# Altium schematic sheet Sheet1.SchDoc
size A4; SheetNumber: 1; SheetTotal: 1
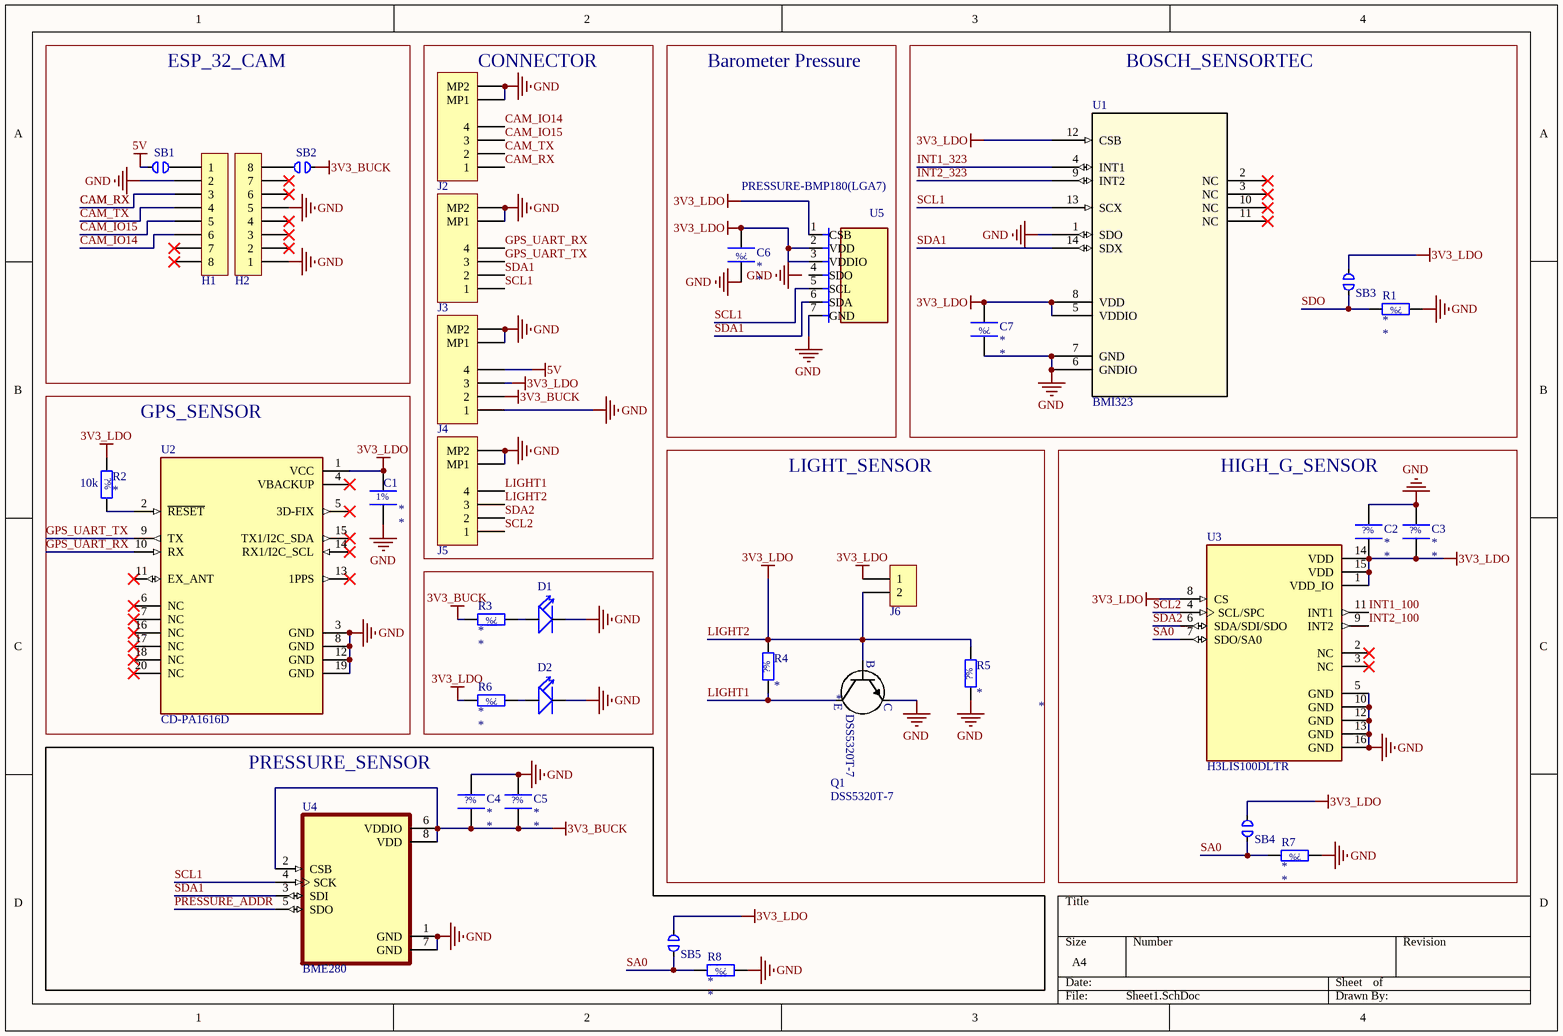
[diagram p0: Sheet1.SchDoc]

## Parts
C1  *  [CAPACITOR_0805_2012M-70N]
C2  *  [CAPACITOR_0805_2012M-70N]
C3  *  [CAPACITOR_0805_2012M-70N]
C4  *  [CAPACITOR_0805_2012M-70N]
C5  *  [CAPACITOR_0805_2012M-70N]
C6  *  [CAPACITOR_0805_2012M-70N]
C7  *  [CAPACITOR_0805_2012M-70N]
D1  LED-SMD-RED-DIFFUSED(0603)  [LED-0603]  (value not drawn)
D2  LED-SMD-RED-DIFFUSED(0603)  [LED-0603]  (value not drawn)
H1  HDR,2.54mm,1x8  [HEADER_2.54MM_1x8PIN]  (value not drawn)  (no BOM)
H2  HDR,2.54mm,1x8  [HEADER_2.54MM_1x8PIN]  (value not drawn)  (no BOM)
J2  0533980471  [MOLEX_0533980471]  (value not drawn)
J3  0533980471  [MOLEX_0533980471]  (value not drawn)
J4  0533980471  [MOLEX_0533980471]  (value not drawn)
J5  0533980471  [MOLEX_0533980471]  (value not drawn)
J6  0530470210  [MOLEX_0530470210]  (value not drawn)
Q1  DSS5320T-7  [SOT23-3N-1.15mm]
R1  *  [RESISTOR_0805_2012M-50N]
R2  R1: 10k  [RESISTOR_0805_2012M-50N]  (hidden comment: 5=Value)
R3  *  [RESISTOR_0805_2012M-50N]
R4  *  [RESISTOR_0805_2012M-50N]
R5  *  [RESISTOR_0805_2012M-50N]
R6  *  [RESISTOR_0805_2012M-50N]
R7  *  [RESISTOR_0805_2012M-50N]
R8  *  [RESISTOR_0805_2012M-50N]
SB1  Solder Jumper Normally Open  [Solder bridge Chevron 0603 Open]  (value not drawn)  (no BOM)
SB2  Solder Jumper Normally Open  [Solder bridge Chevron 0603 Open]  (value not drawn)  (no BOM)
SB3  Solder Jumper Normally Open  [Solder bridge Chevron 0603 Open]  (value not drawn)  (no BOM)
SB4  Solder Jumper Normally Open  [Solder bridge Chevron 0603 Open]  (value not drawn)  (no BOM)
SB5  Solder Jumper Normally Open  [Solder bridge Chevron 0603 Open]  (value not drawn)  (no BOM)
U1  BMI323  [BMI323_BOS]
U2  CD-PA1616D  [XCVR_CD-PA1616D]
U3  H3LIS100DLTR  [PQFN50P300X300X100-16N]
U4  BME280  [PSON65P250X250X100-8N]
U5  PRESSURE-BMP180(LGA7)  [LGA7-1.5-3.8X3.6MM]

## Blocks framed on the sheet
ESP_32_CAM: H1 H2 SB1 SB2
CONNECTOR: J2-J5
Barometer Pressure: C6 U5
BOSCH_SENSORTEC: C7 R1 SB3 U1
GPS_SENSOR: C1 R2 U2
LIGHT_SENSOR: J6 Q1 R4 R5
HIGH_G_SENSOR: C2 C3 R7 SB4 U3
PRESSURE_SENSOR: C4 C5 R8 SB5 U4

## Nets
3V3_BUCK: C4.1 C5.1 J4.2 R3.2 SB2.2 U4.2(CSB) U4.6(VDDIO) U4.8(VDD)
5V: J4.4 SB1.1
GND: C1.1 C2.2 C3.2 C4.2 C5.2 C6.2 C7.2 D1.NEG D2.NEG H1.2 H2.1 H2.5 J2.MP1 J2.MP2 J3.MP1 J3.MP2 J4.1 J4.MP1 J4.MP2 J5.MP1 J5.MP2 Q1.3(C) R1.1 R5.1 R7.1 R8.1 U1.1(SDO) U1.6(GNDIO) U1.7(GND) U2.3(GND) U2.8(GND) U2.12(GND) U2.19(GND) U3.5(GND) U3.10(GND) U3.12(GND) U3.13(GND) U3.16(GND) U4.1(GND) U4.7(GND) U5.7(GND)
LIGHT2: C1.2 C2.1 C3.1 C6.1 C7.1 J4.3 J5.3 J6.1 J6.2 Q1.1(B) R2.1 R4.2 R5.2 R6.2 SB3.2 SB4.2 SB5.2 U1.5(VDDIO) U1.8(VDD) U1.12(CSB) U2.1(VCC) U3.1(VDD_IO) U3.8(CS) U3.14(VDD) U3.15(VDD) U5.1(CSB) U5.2(VDD) U5.3(VDDIO)  [also labelled 3V3_LDO]
CAM_IO14: H1.6 J2.4
CAM_IO15: H1.5 J2.3
CAM_RX: H1.3 J2.1
CAM_TX: H1.4 J2.2
GPS_UART_RX: J3.4 U2.10(RX)
GPS_UART_TX: J3.3 U2.9(TX)
INT1_100: U3.11(INT1)
INT1_323: U1.4(INT1)
INT2_100: U3.9(INT2)
INT2_323: U1.9(INT2)
LIGHT1: J5.4 Q1.2(E) R4.1
PRESSURE_ADDR: U4.5(SDO)
SA0: R7.2 R8.2 SB4.1 SB5.1 U3.7(SDO/SA0)
SCL1: J3.1 U1.13(SCX) U4.4(SCK) U5.5(SCL)
SCL2: J5.1 U3.4(SCL/SPC)
SDA1: J3.2 U1.14(SDX) U4.3(SDI) U5.6(SDA)
SDA2: J5.2 U3.6(SDA/SDI/SDO)
SDO: R1.2 SB3.1
NetD1_POS: D1.POS R3.1
NetD2_POS: D2.POS R6.1
NetH1_1: H1.1 SB1.2
NetH2_8: H2.8 SB2.1
NetR2_2: R2.2 U2.2(~{RESET})

Not connected (* = marked no-connect by the designer): H1 7* 8*; H2 2* 3* 4* 6* 7*; U1 2(NC)* 3(NC)* 10(NC)* 11(NC)*; U2 4(VBACKUP)* 5(3D-FIX)* 6(NC)* 7(NC)* 11(EX_ANT)* 13(1PPS)* 14(RX1/I2C_SCL)* 15(TX1/I2C_SDA)* 16(NC)* 17(NC)* 18(NC)* 20(NC)*; U3 2(NC)* 3(NC)*; U5 4(SDO)

## Notes on the sheet
- Labels drawn without touching a wire or pin: GND

## Library data of the parts
C1 = Generic Capacitor: Passive - Capacitor, Generic; Tolerance: 1%; MF Part No.: *; Value: *
C2-C7 = Generic Capacitor: Passive - Capacitor, Generic; Tolerance: ?%; MF Part No.: *; Value: *
D1 D2 = LED-SMD-RED-DIFFUSED(0603): Red - LED Indication - Discrete 1.95V 0603 (1608 Metric); MF: Everlight Electronics; MP: 19-217/R6C-AL1M2VY/3T; SnapEDA_Link: https://www.snapeda.com/parts/19-217/R6C-AL1M2VY/3T/Everlight/view-part/?ref=snap; Package: 0603 Everlight Electronics; Value: *; Check_prices: https://www.snapeda.com/parts/19-217/R6C-AL1M2VY/3T/Everlight/view-part/?ref=eda
H1 H2 = HDR,2.54mm,1x8: Connector - 2.54mm, 1x8-pin
J2-J5 = 0533980471: Connector - Picoblade 04-pin, SMT, STR; APSS Standard Part: APSS Standard; Pitch: 1.25mm; Mounting Type: Surface Mount; Orientation: Straight; MF Part No.: 0533980471; Pins: 4; Supplier 1: Digikey; Supplier 1 Part No.: WM7608CT-ND
J6 = 0530470210: Connector - Picoblade 02-pin, TH, STR; APSS Standard Part: APSS Standard; Pitch: 1.25mm; Mounting Type: Through-hole; Orientation: Straight; MF Part No.: 0530470210; Pins: 2; Supplier 1: Digikey; Supplier 1 Part No.: WM1731-ND
Q1 = DSS5320T-7: Transistor - BJT PNP DSS5320T-7; APSS Standard Part: APSS Standard; Temp Range: -55°C ~ 150°C (TJ); Rated Voltage: 20 Vce; Power: 600mW; MF Part No.: DSS5320T-7; Package: SOT-23-3; Supplier 1: Digikey; Supplier 1 Part No.: DSS5320T-7DICT-ND
R1-R8 = Generic Resistor: Passive - Resistor, Generic; Tolerance: ?%; MF Part No.: *
  R1 R3-R8: Value: *
U1 = BMI323: Description; Manufacturer_Name: Bosch Sensortec; Copyright: Copyright (C) 2026 Ultra Librarian. All rights reserved.; Manufacturer_Part_Number: BMI323; RefDes: RefDes; Type: Type
U2 = CD-PA1616D: CD-PA1616DGNSS patch antenna module; MF: CD Top; SnapEDA_Link: https://www.snapeda.com/parts/CD-PA1616D/CD+technology/view-part/?ref=snap; Package: Package; Value: *; MP: CD-PA1616D; Check_prices: https://www.snapeda.com/parts/CD-PA1616D/CD+technology/view-part/?ref=eda
U3 = H3LIS100DLTR: Accelerometer X, Y, Z Axis Â±100g 25Hz ~ 200Hz 16-TFLGA (3x3); MF: STMicroelectronics; SnapEDA_Link: https://www.snapeda.com/parts/H3LIS100DLTR/STMicroelectronics/view-part/?ref=snap; Package: TFLGA-16 STMicroelectronics; Value: *; MP: H3LIS100DLTR; Check_prices: https://www.snapeda.com/parts/H3LIS100DLTR/STMicroelectronics/view-part/?ref=eda
U4 = BME280: Board Mount Humidity Sensors MEMS humidity, pressure and temperature sensor; MF: Bosch; SnapEDA_Link: https://www.snapeda.com/parts/BME280/Bosch/view-part/?ref=snap; Package: LGA-8 Bosch; Value: *; MP: BME280; Check_prices: https://www.snapeda.com/parts/BME280/Bosch/view-part/?ref=eda
U5 = PRESSURE-BMP180(LGA7): Pressure Sensor 4.35PSI ~ 15.95PSI (30kPa ~ 110kPa) Absolute - 16 ~ 19 b 7-VLGA; MF: Bosch; MP: BMP180; SnapEDA_Link: https://www.snapeda.com/parts/BMP180/Bosch/view-part/?ref=snap; Package: LGA-7 Bosch; Value: *; Check_prices: https://www.snapeda.com/parts/BMP180/Bosch/view-part/?ref=eda
SB1-SB5 = Solder Jumper Normally Open: DEBUG: DEBUG